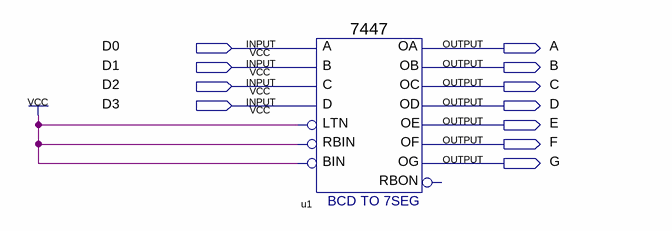
[diagram p0: schematic sheet]
// Quartus schematic bcd2display.bdf as structural Verilog: 1 symbols, 11 pins
module bcd2display (
  input  D0,
  input  D1,
  input  D2,
  input  D3,
  output A,
  output B,
  output C,
  output D,
  output E,
  output F,
  output G
);

  \7447  u1 (
    .LTN(1'b1), .B(D1), .C(D2), .D(D3), .RBIN(1'b1), .BIN(1'b1), .A(D0), .OB(B), .OC(C), .OE(E), .OD(D),
    .OF(F), .OG(G), .OA(A));  // open: RBON
endmodule
